# Altium schematic sheet [02].HMS.BW16.SchDoc
size A4; SheetNumber: 3; SheetTotal: 7
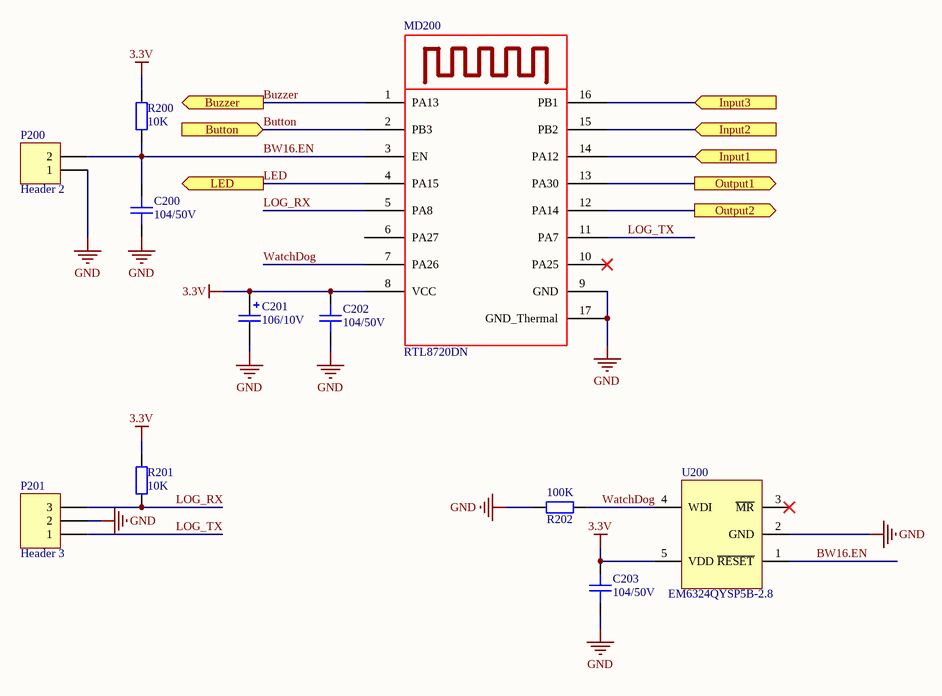
[diagram p0: [02].HMS.BW16.SchDoc]

## Parts
C200  104/50V  [CAP_CERAMIC_0402(1005)]
C201  106/10V  [CAP_TANTAL_1206(3216-18)]
C202  104/50V  [CAP_CERAMIC_0402(1005)]
C203  104/50V  [CAP_CERAMIC_0402(1005)]
MD200  RTL8720DN  [BW16]
P200  Header 2  [HDR1X2]
P201  Header 3  [HDR1X3]
R200  10K  [RES_0402(1005)]
R201  10K  [RES_0402(1005)]
R202  100K  [RES_0402(1005)]
U200  EM6324QYSP5B-2.8  [SOT23-5]

## Ports
Button (in), Buzzer (out), Input1 (in), Input2 (in), Input3 (in), LED (out), Output1 (out), Output2 (out)

## Nets
3.3V: C201.1 C202.1 C203.1 MD200.8(VCC) R200.1 R201.2 U200.5(VDD)
GND: C200.2 C201.2 C202.2 C203.2 MD200.9(GND) MD200.17(GND_Thermal) P200.1 P201.2 R202.2 U200.2(GND)
Button: MD200.2(PB3) ; port Button
Buzzer: MD200.1(PA13) ; port Buzzer
BW16.EN: C200.1 MD200.3(EN) P200.2 R200.2 U200.1(~{RESET})
Input1: MD200.14(PA12) ; port Input1
Input2: MD200.15(PB2) ; port Input2
Input3: MD200.16(PB1) ; port Input3
LED: MD200.4(PA15) ; port LED
LOG_RX: MD200.5(PA8) P201.3 R201.1
LOG_TX: MD200.11(PA7) P201.1
Output1: MD200.13(PA30) ; port Output1
Output2: MD200.12(PA14) ; port Output2
WatchDog: MD200.7(PA26) R202.1 U200.4(WDI)

Not connected (* = marked no-connect by the designer): MD200 6(PA27) 10(PA25)*; U200 3(~{MR})*

## Library data of the parts
C200 C202 C203 = CC0402KRX5R9BB104: CAP CER 0.1UF 50V X5R 0402; MFR: YAGEO; MPN: CC0402KRX5R9BB104; Category: Ceramic Capacitors; Value: 104/50V
C201 = TAJC107K010RNJ: CAP Tantal 10uF/6.3V 10% 1206; MPN: 293D106X96R3A2TE3; MFR: KYOCERA AVX Componenis; Value: 107/10V
MD200 = RTL8720DN: Module dual wifi 2.4GHz/5.8GHz + BL 5.0; MPN: RTL8720DN
P200 = Header 2: Header, 2-Pin; LatestRevisionDate: 17-Jul-2002; LatestRevisionNote: Re-released for DXP Platform.; Publisher: Altium Limited; NPN: Header 2
P201 = Header 3: Header, 3-Pin; LatestRevisionDate: 17-Jul-2002; LatestRevisionNote: Re-released for DXP Platform.; Publisher: Altium Limited; NPN: Header 3
R200 = RC0402JR-0710KL: RES 10K OHM 5% 1/8W 0402; MFR: YAGEO; Voltage Rating: 50V; Power Rating: 1/16W; MPN: RC0402JR-0710KL; Value: 10K; Category: 0402; Tolerance: 5%
R201 R202 = RC0402JR-0710KL: RES 10K OHM 5% 1/8W 0402; MFR: YAGEO; Value: NC; Voltage Rating: 50V; Power Rating: 1/16W; MPN: RC0402JR-0710KL; Category: 0402; Tolerance: 5%
U200 = EM6324QYSP5B: External watchdog reset; Value: EM6324QYSP5B-2.8